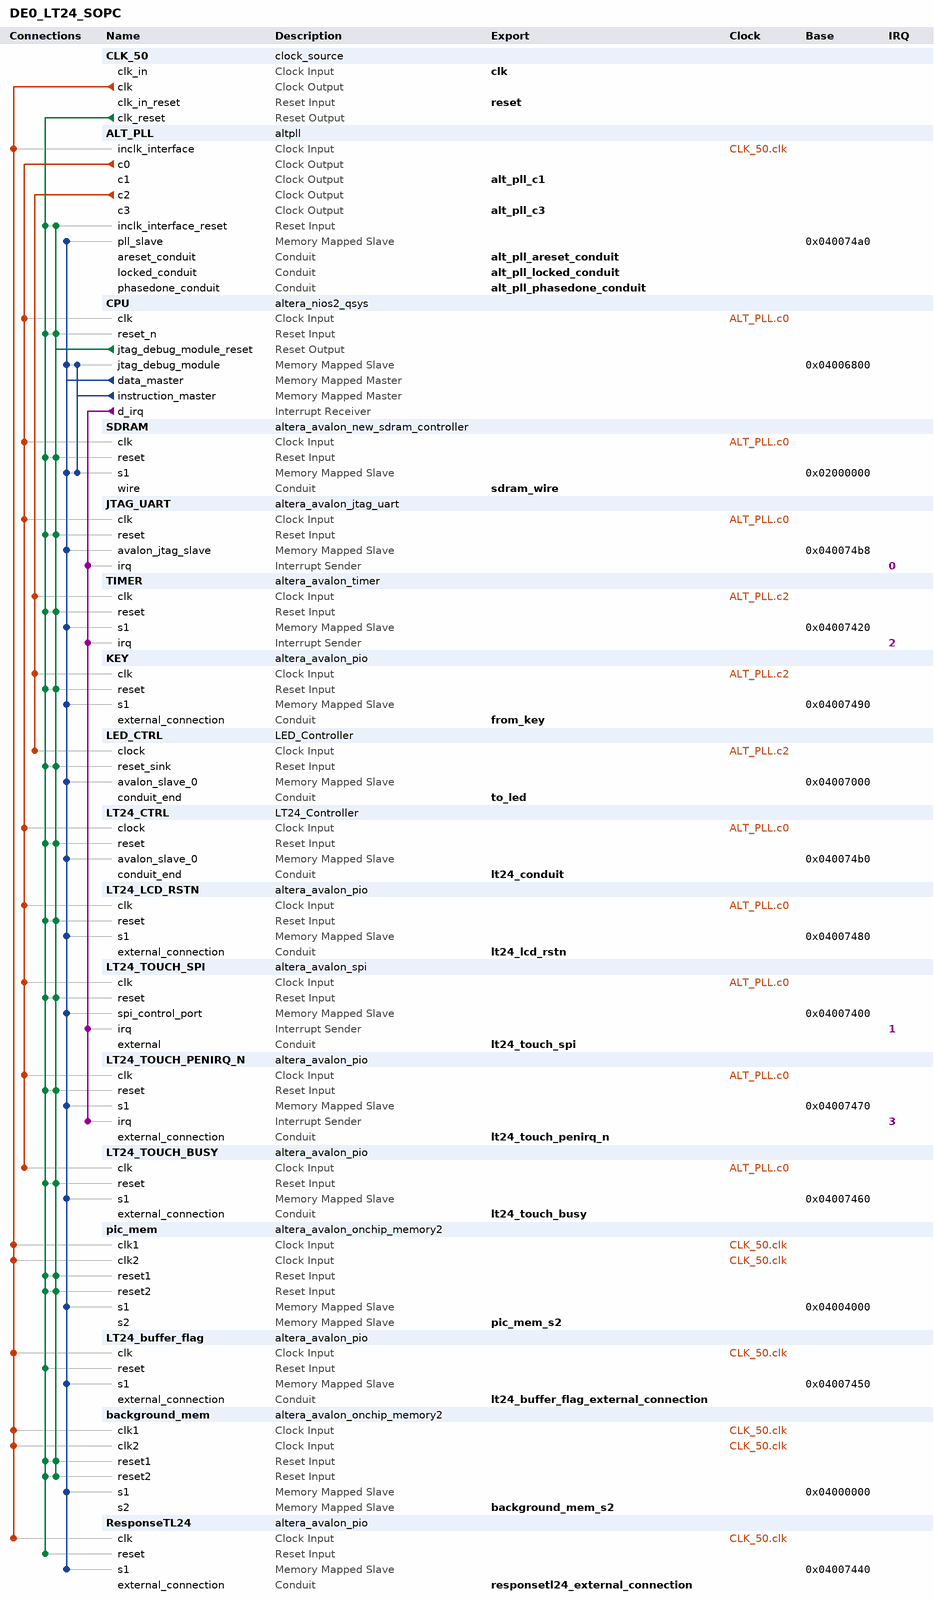
[diagram p0: system contents]
# Platform Designer (Qsys) system DE0_LT24_SOPC, Cyclone IV E EP4CE22F17C6
# Parameters at their usual value, and those the tool derives, are not listed.
package require -exact qsys 15.0
create_system DE0_LT24_SOPC
set_project_property DEVICE_FAMILY {Cyclone IV E}
set_project_property DEVICE EP4CE22F17C6

add_instance CLK_50 clock_source 15.0
set_instance_parameter_value CLK_50 clockFrequency 50000000

add_instance ALT_PLL altpll 15.0
set_instance_parameter_value ALT_PLL CLK0_DIVIDE_BY 1
set_instance_parameter_value ALT_PLL CLK0_MULTIPLY_BY 1
set_instance_parameter_value ALT_PLL CLK1_DIVIDE_BY 1
set_instance_parameter_value ALT_PLL CLK1_DUTY_CYCLE 50
set_instance_parameter_value ALT_PLL CLK1_MULTIPLY_BY 1
set_instance_parameter_value ALT_PLL CLK1_PHASE_SHIFT -5000
set_instance_parameter_value ALT_PLL CLK2_DIVIDE_BY 5
set_instance_parameter_value ALT_PLL CLK2_DUTY_CYCLE 50
set_instance_parameter_value ALT_PLL CLK2_MULTIPLY_BY 1
set_instance_parameter_value ALT_PLL CLK2_PHASE_SHIFT 0
set_instance_parameter_value ALT_PLL CLK3_DIVIDE_BY 5
set_instance_parameter_value ALT_PLL CLK3_DUTY_CYCLE 50
set_instance_parameter_value ALT_PLL CLK3_MULTIPLY_BY 4
set_instance_parameter_value ALT_PLL CLK3_PHASE_SHIFT 0
set_instance_parameter_value ALT_PLL CLK4_DIVIDE_BY 25
set_instance_parameter_value ALT_PLL CLK4_DUTY_CYCLE 50
set_instance_parameter_value ALT_PLL CLK4_MULTIPLY_BY 1
set_instance_parameter_value ALT_PLL CLK4_PHASE_SHIFT 0
set_instance_parameter_value ALT_PLL INCLK0_INPUT_FREQUENCY 20000
set_instance_parameter_value ALT_PLL PORT_ARESET PORT_USED
set_instance_parameter_value ALT_PLL PORT_LOCKED PORT_USED
set_instance_parameter_value ALT_PLL PORT_clk1 PORT_USED
set_instance_parameter_value ALT_PLL PORT_clk2 PORT_USED
set_instance_parameter_value ALT_PLL PORT_clk3 PORT_USED
set_instance_parameter_value ALT_PLL PORT_clk4 PORT_USED

add_instance CPU altera_nios2_qsys 15.0
set_instance_parameter_value CPU breakSlave CPU.jtag_debug_module
set_instance_parameter_value CPU exceptionSlave SDRAM.s1
set_instance_parameter_value CPU icache_size 4096
set_instance_parameter_value CPU impl Fast
set_instance_parameter_value CPU mmu_TLBMissExcSlave None
set_instance_parameter_value CPU resetSlave SDRAM.s1
set_instance_parameter_value CPU resetrequest_enabled true

add_instance SDRAM altera_avalon_new_sdram_controller 15.0
set_instance_parameter_value SDRAM TAC 5.5
set_instance_parameter_value SDRAM TRCD 20.0
set_instance_parameter_value SDRAM TRP 20.0
set_instance_parameter_value SDRAM casLatency 3
set_instance_parameter_value SDRAM columnWidth 9
set_instance_parameter_value SDRAM dataWidth 16
set_instance_parameter_value SDRAM generateSimulationModel false
set_instance_parameter_value SDRAM model single_Micron_MT48LC4M32B2_7_chip
set_instance_parameter_value SDRAM numberOfBanks 4
set_instance_parameter_value SDRAM numberOfChipSelects 1
set_instance_parameter_value SDRAM powerUpDelay 100.0
set_instance_parameter_value SDRAM refreshPeriod 15.625
set_instance_parameter_value SDRAM rowWidth 13

add_instance JTAG_UART altera_avalon_jtag_uart 15.0
set_instance_parameter_value JTAG_UART simInteractiveOptions NO_INTERACTIVE_WINDOWS

add_instance TIMER altera_avalon_timer 15.0
set_instance_parameter_value TIMER period 2
set_instance_parameter_value TIMER periodUnits MSEC

add_instance KEY altera_avalon_pio 15.0
set_instance_parameter_value KEY direction Input
set_instance_parameter_value KEY width 1

add_instance LED_CTRL LED_Controller 1.1

add_instance LT24_CTRL LT24_Controller 1.0

add_instance LT24_LCD_RSTN altera_avalon_pio 15.0
set_instance_parameter_value LT24_LCD_RSTN direction Output
set_instance_parameter_value LT24_LCD_RSTN width 1

add_instance LT24_TOUCH_SPI altera_avalon_spi 15.0
set_instance_parameter_value LT24_TOUCH_SPI clockPolarity 0
set_instance_parameter_value LT24_TOUCH_SPI dataWidth 8
set_instance_parameter_value LT24_TOUCH_SPI masterSPI true
set_instance_parameter_value LT24_TOUCH_SPI numberOfSlaves 1
set_instance_parameter_value LT24_TOUCH_SPI targetClockRate 32000

add_instance LT24_TOUCH_PENIRQ_N altera_avalon_pio 15.0
set_instance_parameter_value LT24_TOUCH_PENIRQ_N captureEdge true
set_instance_parameter_value LT24_TOUCH_PENIRQ_N direction Input
set_instance_parameter_value LT24_TOUCH_PENIRQ_N edgeType FALLING
set_instance_parameter_value LT24_TOUCH_PENIRQ_N generateIRQ true
set_instance_parameter_value LT24_TOUCH_PENIRQ_N irqType EDGE
set_instance_parameter_value LT24_TOUCH_PENIRQ_N width 1

add_instance LT24_TOUCH_BUSY altera_avalon_pio 15.0
set_instance_parameter_value LT24_TOUCH_BUSY direction Input
set_instance_parameter_value LT24_TOUCH_BUSY width 1

add_instance pic_mem altera_avalon_onchip_memory2 15.0
set_instance_parameter_value pic_mem dataWidth 16
set_instance_parameter_value pic_mem dualPort true
set_instance_parameter_value pic_mem initMemContent true
set_instance_parameter_value pic_mem initializationFileName ".\\myCharac.hex"
set_instance_parameter_value pic_mem memorySize 8192
set_instance_parameter_value pic_mem useNonDefaultInitFile true

add_instance LT24_buffer_flag altera_avalon_pio 15.0
set_instance_parameter_value LT24_buffer_flag direction Output
set_instance_parameter_value LT24_buffer_flag width 1

add_instance background_mem altera_avalon_onchip_memory2 15.0
set_instance_parameter_value background_mem dataWidth 16
set_instance_parameter_value background_mem dualPort true
set_instance_parameter_value background_mem initMemContent true
set_instance_parameter_value background_mem initializationFileName ".\\myBackground.hex"
set_instance_parameter_value background_mem memorySize 9600
set_instance_parameter_value background_mem useNonDefaultInitFile true

add_instance ResponseTL24 altera_avalon_pio 15.0
set_instance_parameter_value ResponseTL24 direction Input
set_instance_parameter_value ResponseTL24 width 8

# connections
add_connection ALT_PLL.c0 CPU.clk clock
add_connection ALT_PLL.c0 JTAG_UART.clk clock
add_connection ALT_PLL.c0 LT24_CTRL.clock clock
add_connection ALT_PLL.c0 LT24_LCD_RSTN.clk clock
add_connection ALT_PLL.c0 LT24_TOUCH_BUSY.clk clock
add_connection ALT_PLL.c0 LT24_TOUCH_PENIRQ_N.clk clock
add_connection ALT_PLL.c0 LT24_TOUCH_SPI.clk clock
add_connection ALT_PLL.c0 SDRAM.clk clock
add_connection ALT_PLL.c2 KEY.clk clock
add_connection ALT_PLL.c2 LED_CTRL.clock clock
add_connection ALT_PLL.c2 TIMER.clk clock
add_connection CLK_50.clk ALT_PLL.inclk_interface clock
add_connection CLK_50.clk background_mem.clk1 clock
add_connection CLK_50.clk background_mem.clk2 clock
add_connection CLK_50.clk LT24_buffer_flag.clk clock
add_connection CLK_50.clk pic_mem.clk1 clock
add_connection CLK_50.clk pic_mem.clk2 clock
add_connection CLK_50.clk ResponseTL24.clk clock
add_connection CLK_50.clk_reset ALT_PLL.inclk_interface_reset reset
add_connection CLK_50.clk_reset background_mem.reset1 reset
add_connection CLK_50.clk_reset background_mem.reset2 reset
add_connection CLK_50.clk_reset CPU.reset_n reset
add_connection CLK_50.clk_reset JTAG_UART.reset reset
add_connection CLK_50.clk_reset KEY.reset reset
add_connection CLK_50.clk_reset LED_CTRL.reset_sink reset
add_connection CLK_50.clk_reset LT24_buffer_flag.reset reset
add_connection CLK_50.clk_reset LT24_CTRL.reset reset
add_connection CLK_50.clk_reset LT24_LCD_RSTN.reset reset
add_connection CLK_50.clk_reset LT24_TOUCH_BUSY.reset reset
add_connection CLK_50.clk_reset LT24_TOUCH_PENIRQ_N.reset reset
add_connection CLK_50.clk_reset LT24_TOUCH_SPI.reset reset
add_connection CLK_50.clk_reset pic_mem.reset1 reset
add_connection CLK_50.clk_reset pic_mem.reset2 reset
add_connection CLK_50.clk_reset ResponseTL24.reset reset
add_connection CLK_50.clk_reset SDRAM.reset reset
add_connection CLK_50.clk_reset TIMER.reset reset
add_connection CPU.jtag_debug_module_reset ALT_PLL.inclk_interface_reset reset
add_connection CPU.jtag_debug_module_reset background_mem.reset1 reset
add_connection CPU.jtag_debug_module_reset background_mem.reset2 reset
add_connection CPU.jtag_debug_module_reset CPU.reset_n reset
add_connection CPU.jtag_debug_module_reset JTAG_UART.reset reset
add_connection CPU.jtag_debug_module_reset KEY.reset reset
add_connection CPU.jtag_debug_module_reset LED_CTRL.reset_sink reset
add_connection CPU.jtag_debug_module_reset LT24_CTRL.reset reset
add_connection CPU.jtag_debug_module_reset LT24_LCD_RSTN.reset reset
add_connection CPU.jtag_debug_module_reset LT24_TOUCH_BUSY.reset reset
add_connection CPU.jtag_debug_module_reset LT24_TOUCH_PENIRQ_N.reset reset
add_connection CPU.jtag_debug_module_reset LT24_TOUCH_SPI.reset reset
add_connection CPU.jtag_debug_module_reset pic_mem.reset1 reset
add_connection CPU.jtag_debug_module_reset pic_mem.reset2 reset
add_connection CPU.jtag_debug_module_reset SDRAM.reset reset
add_connection CPU.jtag_debug_module_reset TIMER.reset reset
add_connection CPU.data_master ALT_PLL.pll_slave avalon
set_connection_parameter_value CPU.data_master/ALT_PLL.pll_slave baseAddress 0x040074a0
add_connection CPU.data_master background_mem.s1 avalon
set_connection_parameter_value CPU.data_master/background_mem.s1 baseAddress 0x04000000
add_connection CPU.data_master CPU.jtag_debug_module avalon
set_connection_parameter_value CPU.data_master/CPU.jtag_debug_module baseAddress 0x04006800
add_connection CPU.data_master JTAG_UART.avalon_jtag_slave avalon
set_connection_parameter_value CPU.data_master/JTAG_UART.avalon_jtag_slave baseAddress 0x040074b8
add_connection CPU.data_master KEY.s1 avalon
set_connection_parameter_value CPU.data_master/KEY.s1 baseAddress 0x04007490
add_connection CPU.data_master LED_CTRL.avalon_slave_0 avalon
set_connection_parameter_value CPU.data_master/LED_CTRL.avalon_slave_0 baseAddress 0x04007000
add_connection CPU.data_master LT24_buffer_flag.s1 avalon
set_connection_parameter_value CPU.data_master/LT24_buffer_flag.s1 baseAddress 0x04007450
add_connection CPU.data_master LT24_CTRL.avalon_slave_0 avalon
set_connection_parameter_value CPU.data_master/LT24_CTRL.avalon_slave_0 baseAddress 0x040074b0
add_connection CPU.data_master LT24_LCD_RSTN.s1 avalon
set_connection_parameter_value CPU.data_master/LT24_LCD_RSTN.s1 baseAddress 0x04007480
add_connection CPU.data_master LT24_TOUCH_BUSY.s1 avalon
set_connection_parameter_value CPU.data_master/LT24_TOUCH_BUSY.s1 baseAddress 0x04007460
add_connection CPU.data_master LT24_TOUCH_PENIRQ_N.s1 avalon
set_connection_parameter_value CPU.data_master/LT24_TOUCH_PENIRQ_N.s1 baseAddress 0x04007470
add_connection CPU.data_master LT24_TOUCH_SPI.spi_control_port avalon
set_connection_parameter_value CPU.data_master/LT24_TOUCH_SPI.spi_control_port baseAddress 0x04007400
add_connection CPU.data_master pic_mem.s1 avalon
set_connection_parameter_value CPU.data_master/pic_mem.s1 baseAddress 0x04004000
add_connection CPU.data_master ResponseTL24.s1 avalon
set_connection_parameter_value CPU.data_master/ResponseTL24.s1 baseAddress 0x04007440
add_connection CPU.data_master SDRAM.s1 avalon
set_connection_parameter_value CPU.data_master/SDRAM.s1 baseAddress 0x02000000
add_connection CPU.data_master TIMER.s1 avalon
set_connection_parameter_value CPU.data_master/TIMER.s1 baseAddress 0x04007420
add_connection CPU.instruction_master CPU.jtag_debug_module avalon
set_connection_parameter_value CPU.instruction_master/CPU.jtag_debug_module baseAddress 0x04006800
add_connection CPU.instruction_master SDRAM.s1 avalon
set_connection_parameter_value CPU.instruction_master/SDRAM.s1 baseAddress 0x02000000
add_connection CPU.d_irq JTAG_UART.irq interrupt
set_connection_parameter_value CPU.d_irq/JTAG_UART.irq irqNumber 0
add_connection CPU.d_irq LT24_TOUCH_PENIRQ_N.irq interrupt
set_connection_parameter_value CPU.d_irq/LT24_TOUCH_PENIRQ_N.irq irqNumber 3
add_connection CPU.d_irq LT24_TOUCH_SPI.irq interrupt
set_connection_parameter_value CPU.d_irq/LT24_TOUCH_SPI.irq irqNumber 1
add_connection CPU.d_irq TIMER.irq interrupt
set_connection_parameter_value CPU.d_irq/TIMER.irq irqNumber 2

# exported interfaces
add_interface alt_pll_areset_conduit conduit end
set_interface_property alt_pll_areset_conduit EXPORT_OF ALT_PLL.areset_conduit
add_interface alt_pll_c1 clock source
set_interface_property alt_pll_c1 EXPORT_OF ALT_PLL.c1
add_interface alt_pll_c3 clock source
set_interface_property alt_pll_c3 EXPORT_OF ALT_PLL.c3
add_interface alt_pll_locked_conduit conduit end
set_interface_property alt_pll_locked_conduit EXPORT_OF ALT_PLL.locked_conduit
add_interface alt_pll_phasedone_conduit conduit end
set_interface_property alt_pll_phasedone_conduit EXPORT_OF ALT_PLL.phasedone_conduit
add_interface background_mem_s2 avalon slave
set_interface_property background_mem_s2 EXPORT_OF background_mem.s2
add_interface clk clock sink
set_interface_property clk EXPORT_OF CLK_50.clk_in
add_interface from_key conduit end
set_interface_property from_key EXPORT_OF KEY.external_connection
add_interface lt24_buffer_flag_external_connection conduit end
set_interface_property lt24_buffer_flag_external_connection EXPORT_OF LT24_buffer_flag.external_connection
add_interface lt24_conduit conduit end
set_interface_property lt24_conduit EXPORT_OF LT24_CTRL.conduit_end
add_interface lt24_lcd_rstn conduit end
set_interface_property lt24_lcd_rstn EXPORT_OF LT24_LCD_RSTN.external_connection
add_interface lt24_touch_busy conduit end
set_interface_property lt24_touch_busy EXPORT_OF LT24_TOUCH_BUSY.external_connection
add_interface lt24_touch_penirq_n conduit end
set_interface_property lt24_touch_penirq_n EXPORT_OF LT24_TOUCH_PENIRQ_N.external_connection
add_interface lt24_touch_spi conduit end
set_interface_property lt24_touch_spi EXPORT_OF LT24_TOUCH_SPI.external
add_interface pic_mem_s2 avalon slave
set_interface_property pic_mem_s2 EXPORT_OF pic_mem.s2
add_interface reset reset sink
set_interface_property reset EXPORT_OF CLK_50.clk_in_reset
add_interface responsetl24_external_connection conduit end
set_interface_property responsetl24_external_connection EXPORT_OF ResponseTL24.external_connection
add_interface sdram_wire conduit end
set_interface_property sdram_wire EXPORT_OF SDRAM.wire
add_interface to_led conduit end
set_interface_property to_led EXPORT_OF LED_CTRL.conduit_end

set_interconnect_requirement {$system} qsys_mm.clockCrossingAdapter HANDSHAKE
set_interconnect_requirement {$system} qsys_mm.insertDefaultSlave false
set_interconnect_requirement {$system} qsys_mm.maxAdditionalLatency 1

save_system DE0_LT24_SOPC.qsys
